# EAGLE design TRHPSVG_Controls (EAGLE 9.6.0)
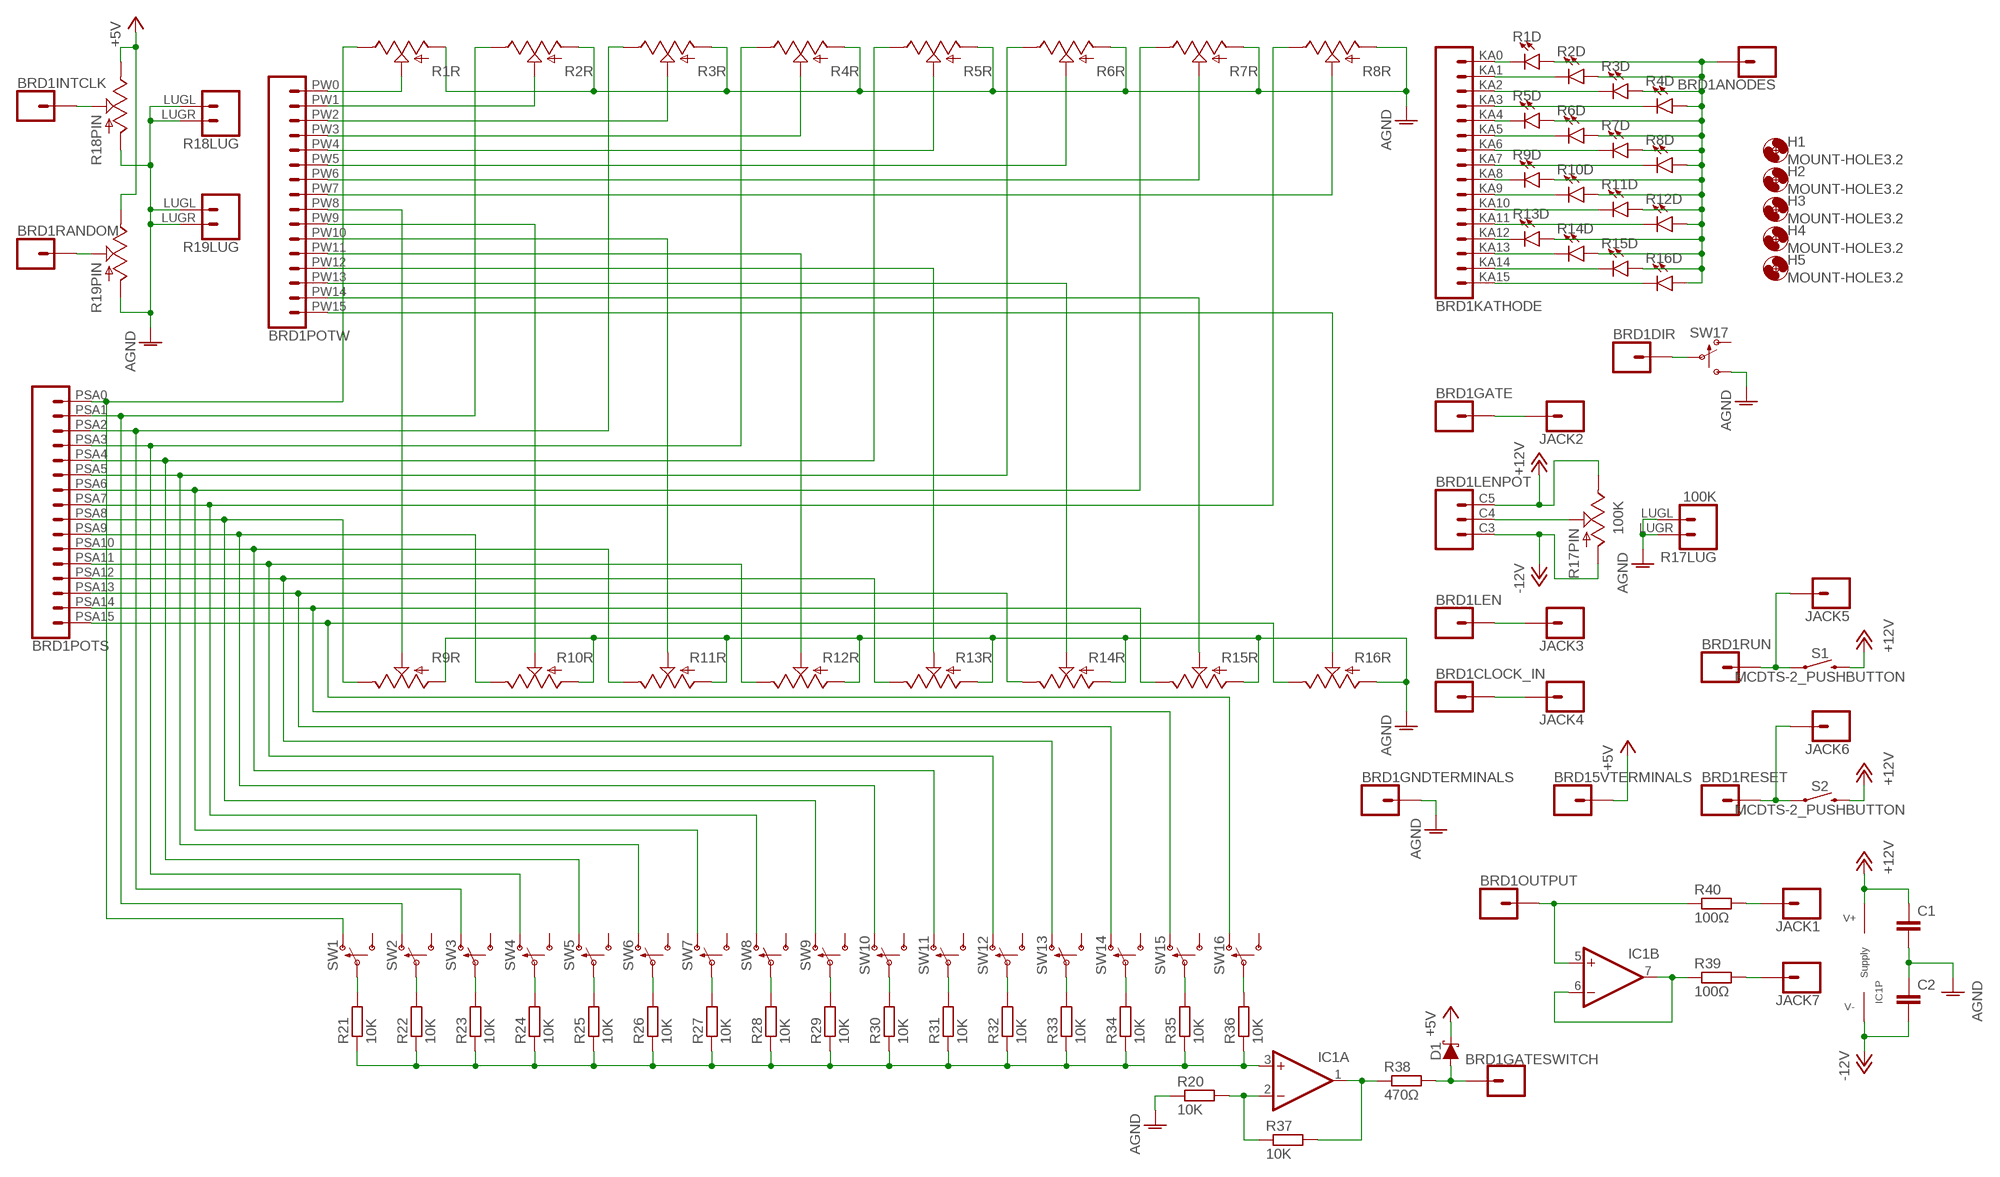
[diagram p0: schematic, sheet 1]

## Parts
BRD1  TRHPSVG_LINK  [TRHPSVG]
C1  C-EU050-025X075  [C050-025X075]
C2  C-EU050-025X075  [C050-025X075]
D1  SCHOTTKY_DO35  [DO35-7]
H1  MOUNT-HOLE3.2  [3,2]
H2  MOUNT-HOLE3.2  [3,2]
H3  MOUNT-HOLE3.2  [3,2]
H4  MOUNT-HOLE3.2  [3,2]
H5  MOUNT-HOLE3.2  [3,2]
IC1  TL0X2DIL  [DIL08]
JACK1  1XWIREPAD  [1X01]
JACK2  1XWIREPAD  [1X01]
JACK3  1XWIREPAD  [1X01]
JACK4  1XWIREPAD  [1X01]
JACK5  1XWIREPAD  [1X01]
JACK6  1XWIREPAD  [1X01]
JACK7  1XWIREPAD  [1X01]
R1  PTL30_SLIDER  [LEDSLIDER45MM]
R2  PTL30_SLIDER  [LEDSLIDER45MM]
R3  PTL30_SLIDER  [LEDSLIDER45MM]
R4  PTL30_SLIDER  [LEDSLIDER45MM]
R5  PTL30_SLIDER  [LEDSLIDER45MM]
R6  PTL30_SLIDER  [LEDSLIDER45MM]
R7  PTL30_SLIDER  [LEDSLIDER45MM]
R8  PTL30_SLIDER  [LEDSLIDER45MM]
R9  PTL30_SLIDER  [LEDSLIDER45MM]
R10  PTL30_SLIDER  [LEDSLIDER45MM]
R11  PTL30_SLIDER  [LEDSLIDER45MM]
R12  PTL30_SLIDER  [LEDSLIDER45MM]
R13  PTL30_SLIDER  [LEDSLIDER45MM]
R14  PTL30_SLIDER  [LEDSLIDER45MM]
R15  PTL30_SLIDER  [LEDSLIDER45MM]
R16  PTL30_SLIDER  [LEDSLIDER45MM]
R17  100K  POTENTIOMETER  [ALPHA_RV09_9MMPOT]
R18  POTENTIOMETER  [ALPHA_RV09_9MMPOT]
R19  POTENTIOMETER  [ALPHA_RV09_9MMPOT]
R20  10K  R-EU_0207/10  [0207/10]
R21  10K  R-EU_0207/10  [0207/10]
R22  10K  R-EU_0207/10  [0207/10]
R23  10K  R-EU_0207/10  [0207/10]
R24  10K  R-EU_0207/10  [0207/10]
R25  10K  R-EU_0207/10  [0207/10]
R26  10K  R-EU_0207/10  [0207/10]
R27  10K  R-EU_0207/10  [0207/10]
R28  10K  R-EU_0207/10  [0207/10]
R29  10K  R-EU_0207/10  [0207/10]
R30  10K  R-EU_0207/10  [0207/10]
R31  10K  R-EU_0207/10  [0207/10]
R32  10K  R-EU_0207/10  [0207/10]
R33  10K  R-EU_0207/10  [0207/10]
R34  10K  R-EU_0207/10  [0207/10]
R35  10K  R-EU_0207/10  [0207/10]
R36  10K  R-EU_0207/10  [0207/10]
R37  10K  R-EU_0207/10  [0207/10]
R38  470Ω  R-EU_0207/10  [0207/10]
R39  100Ω  R-EU_0207/10  [0207/10]
R40  100Ω  R-EU_0207/10  [0207/10]
S1  MCDTS-2_PUSHBUTTON  [MCDTS-2_PUSHBUTTON]
S2  MCDTS-2_PUSHBUTTON  [MCDTS-2_PUSHBUTTON]
SW1  SPDT_SWITCHDW1  [MICRODPDT-DW1]
SW2  SPDT_SWITCHDW1  [MICRODPDT-DW1]
SW3  SPDT_SWITCHDW1  [MICRODPDT-DW1]
SW4  SPDT_SWITCHDW1  [MICRODPDT-DW1]
SW5  SPDT_SWITCHDW1  [MICRODPDT-DW1]
SW6  SPDT_SWITCHDW1  [MICRODPDT-DW1]
SW7  SPDT_SWITCHDW1  [MICRODPDT-DW1]
SW8  SPDT_SWITCHDW1  [MICRODPDT-DW1]
SW9  SPDT_SWITCHDW1  [MICRODPDT-DW1]
SW10  SPDT_SWITCHDW1  [MICRODPDT-DW1]
SW11  SPDT_SWITCHDW1  [MICRODPDT-DW1]
SW12  SPDT_SWITCHDW1  [MICRODPDT-DW1]
SW13  SPDT_SWITCHDW1  [MICRODPDT-DW1]
SW14  SPDT_SWITCHDW1  [MICRODPDT-DW1]
SW15  SPDT_SWITCHDW1  [MICRODPDT-DW1]
SW16  SPDT_SWITCHDW1  [MICRODPDT-DW1]
SW17  SPDT_SWITCHDW1  [MICRODPDT-DW1]

## Nets
+5V: BRD1.C13 BRD1.C14 BRD1.C15 D1.C R18.C3(PIN:B) R19.C3(PIN:B)
+12V: BRD1.C5 C1.1 IC1.8(P:V+) R17.C3(PIN:B) S1.P$3 S1.P$4 S2.P$3 S2.P$4
-12V: BRD1.C3 C2.2 IC1.4(P:V-) R17.C1(PIN:A)
AGND: BRD1.C16 BRD1.C17 BRD1.C18 BRD1.GNDTA0 BRD1.GNDTA1 BRD1.GNDTA2 BRD1.GNDTA3 BRD1.GNDTA4 BRD1.GNDTA5 BRD1.GNDTA6 BRD1.GNDTA7 BRD1.GNDTA8 BRD1.GNDTA9 BRD1.GNDTA10 BRD1.GNDTA11 BRD1.GNDTA12 BRD1.GNDTA13 BRD1.GNDTA14 BRD1.GNDTA15 C1.2 C2.1 R1.S1(R:A) R2.S1(R:A) R3.S1(R:A) R4.S1(R:A) R5.S1(R:A) R6.S1(R:A) R7.S1(R:A) R8.S1(R:A) R9.S1(R:A) R10.S1(R:A) R11.S1(R:A) R12.S1(R:A) R13.S1(R:A) R14.S1(R:A) R15.S1(R:A) R16.S1(R:A) R17.LUGL R17.LUGR R18.C1(PIN:A) R18.LUGL R18.LUGR R19.C1(PIN:A) R19.LUGL R19.LUGR R20.1 SW17.C3(S)
N$1: BRD1.PW0 R1.S2(R:W)
N$2: BRD1.PW3 R4.S2(R:W)
N$3: BRD1.PW1 R2.S2(R:W)
N$4: BRD1.PSA0 R1.S3(R:B) SW1.C1(O)
N$5: BRD1.PSA1 R2.S3(R:B) SW2.C1(O)
N$6: BRD1.PW2 R3.S2(R:W)
N$7: BRD1.PW4 R5.S2(R:W)
N$8: BRD1.PW5 R6.S2(R:W)
N$9: BRD1.PW6 R7.S2(R:W)
N$10: BRD1.PW7 R8.S2(R:W)
N$11: BRD1.PSA2 R3.S3(R:B) SW3.C1(O)
N$12: BRD1.PSA3 R4.S3(R:B) SW4.C1(O)
N$13: BRD1.PSA4 R5.S3(R:B) SW5.C1(O)
N$14: R36.2 SW16.C2(P)
N$15: BRD1.PSA6 R7.S3(R:B) SW7.C1(O)
N$16: BRD1.PSA7 R8.S3(R:B) SW8.C1(O)
N$17: BRD1.PW8 R9.S2(R:W)
N$18: R21.2 SW1.C2(P)
N$19: R22.2 SW2.C2(P)
N$20: BRD1.PW9 R10.S2(R:W)
N$21: R23.2 SW3.C2(P)
N$22: BRD1.PW10 R11.S2(R:W)
N$23: BRD1.PW11 R12.S2(R:W)
N$24: R24.2 SW4.C2(P)
N$25: R25.2 SW5.C2(P)
N$26: BRD1.PW12 R13.S2(R:W)
N$27: BRD1.PW13 R14.S2(R:W)
N$28: BRD1.PSA13 R14.S3(R:B) SW14.C1(O)
N$29: BRD1.PSA14 R15.S3(R:B) SW15.C1(O)
N$30: BRD1.PSA15 R16.S3(R:B) SW16.C1(O)
N$31: BRD1.PW14 R15.S2(R:W)
N$32: BRD1.PW15 R16.S2(R:W)
N$33: BRD1.KA0 R1.SE(D:C)
N$34: BRD1.AN0 BRD1.AN1 BRD1.AN2 BRD1.AN3 R1.SB(D:A) R2.SB(D:A) R3.SB(D:A) R4.SB(D:A) R5.SB(D:A) R6.SB(D:A) R7.SB(D:A) R8.SB(D:A) R9.SB(D:A) R10.SB(D:A) R11.SB(D:A) R12.SB(D:A) R13.SB(D:A) R14.SB(D:A) R15.SB(D:A) R16.SB(D:A)
N$35: BRD1.KA1 R2.SE(D:C)
N$36: BRD1.KA2 R3.SE(D:C)
N$37: BRD1.KA3 R4.SE(D:C)
N$38: BRD1.KA4 R5.SE(D:C)
N$39: BRD1.KA5 R6.SE(D:C)
N$40: BRD1.KA6 R7.SE(D:C)
N$41: BRD1.KA7 R8.SE(D:C)
N$42: BRD1.KA8 R9.SE(D:C)
N$43: BRD1.KA9 R10.SE(D:C)
N$44: BRD1.KA10 R11.SE(D:C)
N$45: BRD1.KA11 R12.SE(D:C)
N$46: BRD1.KA12 R13.SE(D:C)
N$47: BRD1.KA13 R14.SE(D:C)
N$48: BRD1.KA14 R15.SE(D:C)
N$49: BRD1.KA15 R16.SE(D:C)
N$50: BRD1.C2 JACK3.1
N$51: BRD1.C6 JACK4.1
N$52: BRD1.C0 IC1.5(B:+IN) R40.1
N$53: BRD1.C1 JACK2.1
N$54: BRD1.C11 SW17.C2(P)
N$55: BRD1.C4 R17.C2(PIN:W)
N$56: BRD1.PSA5 R6.S3(R:B) SW6.C1(O)
N$57: BRD1.C9 R18.C2(PIN:W)
N$58: BRD1.C10 R19.C2(PIN:W)
N$59: BRD1.C7 JACK5.1 S1.P$1 S1.P$2
N$60: BRD1.C8 JACK6.1 S2.P$1 S2.P$2
N$61: R26.2 SW6.C2(P)
N$62: R27.2 SW7.C2(P)
N$63: R28.2 SW8.C2(P)
N$64: R29.2 SW9.C2(P)
N$65: R30.2 SW10.C2(P)
N$66: R31.2 SW11.C2(P)
N$67: R32.2 SW12.C2(P)
N$68: R33.2 SW13.C2(P)
N$69: BRD1.PSA8 R9.S3(R:B) SW9.C1(O)
N$70: BRD1.PSA10 R11.S3(R:B) SW11.C1(O)
N$71: BRD1.PSA9 R10.S3(R:B) SW10.C1(O)
N$72: BRD1.PSA12 R13.S3(R:B) SW13.C1(O)
N$73: BRD1.PSA11 R12.S3(R:B) SW12.C1(O)
N$74: R34.2 SW14.C2(P)
N$75: R35.2 SW15.C2(P)
N$76: IC1.3(A:+IN) R21.1 R22.1 R23.1 R24.1 R25.1 R26.1 R27.1 R28.1 R29.1 R30.1 R31.1 R32.1 R33.1 R34.1 R35.1 R36.1
N$77: IC1.2(A:-IN) R20.2 R37.1
N$78: IC1.1(A:OUT) R37.2 R38.1
N$79: BRD1.C12 D1.A R38.2
N$80: IC1.6(B:-IN) IC1.7(B:OUT) R39.1
N$81: JACK7.1 R39.2
N$82: JACK1.1 R40.2
Unconnected: SW1.C3(S) SW2.C3(S) SW3.C3(S) SW4.C3(S) SW5.C3(S) SW6.C3(S) SW7.C3(S) SW8.C3(S) SW9.C3(S) SW10.C3(S) SW11.C3(S) SW12.C3(S) SW13.C3(S) SW14.C3(S) SW15.C3(S) SW16.C3(S) SW17.C1(O)

## Library data of the parts
BRD1 = ElectricNoodleBox:TRHPSVG_LINK
C1 C2 = rcl:C-EU: CAPACITOR, European symbol; SPICEPREFIX: C
D1 = ElectricNoodleBox:SCHOTTKY_DO35
H1-H5 = holes:MOUNT-HOLE: MOUNTING HOLE with drill center marker
IC1 = ElectricNoodleBox:TL0X2
JACK1-JACK7 = ElectricNoodleBox:1XWIREPAD
R1-R16 = ElectricNoodleBox:PTL30_SLIDER
R17-R19 = ElectricNoodleBox:POTENTIOMETER
R20-R40 = rcl:R-EU_: RESISTOR, European symbol; SPICEPREFIX: R
S1 S2 = ElectricNoodleBox:MCDTS-2_PUSHBUTTON
SW1-SW17 = ElectricNoodleBox:SPDT_SWITCH

## Board
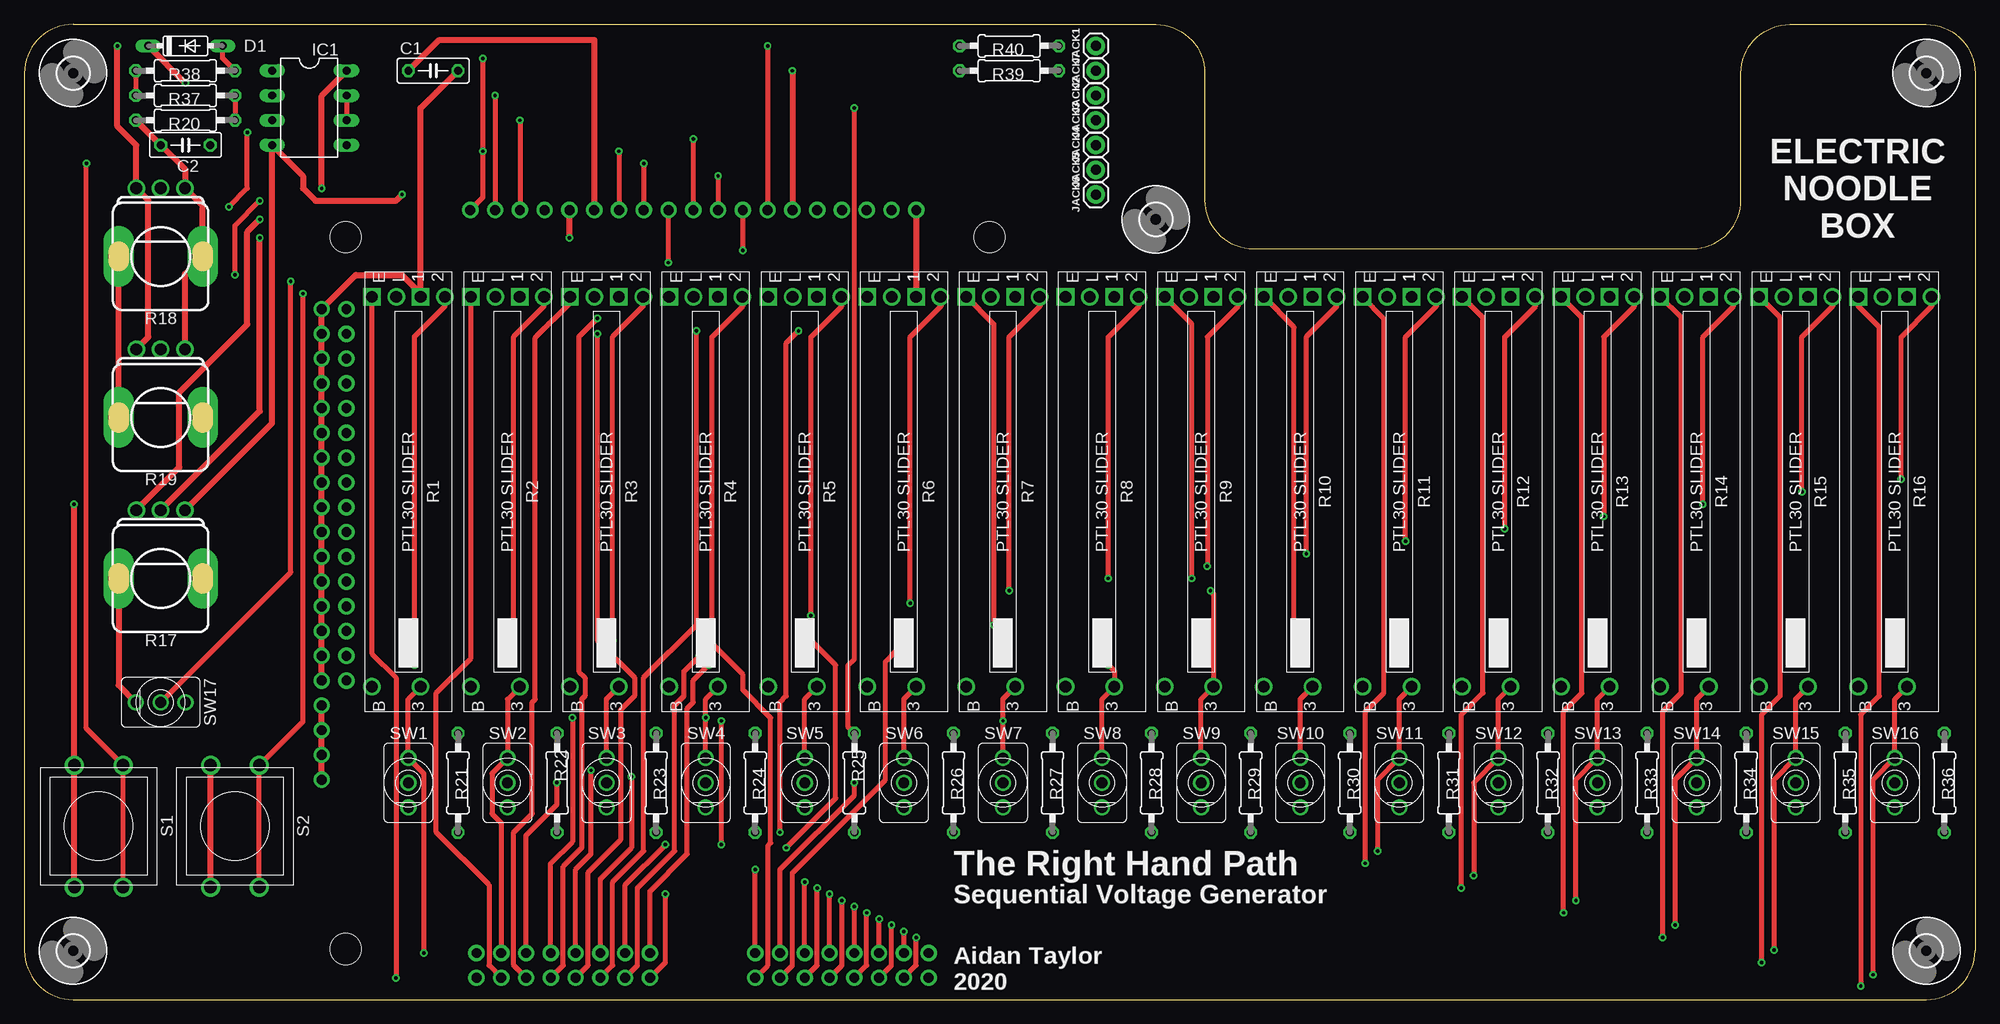
[diagram p1: board, top side]
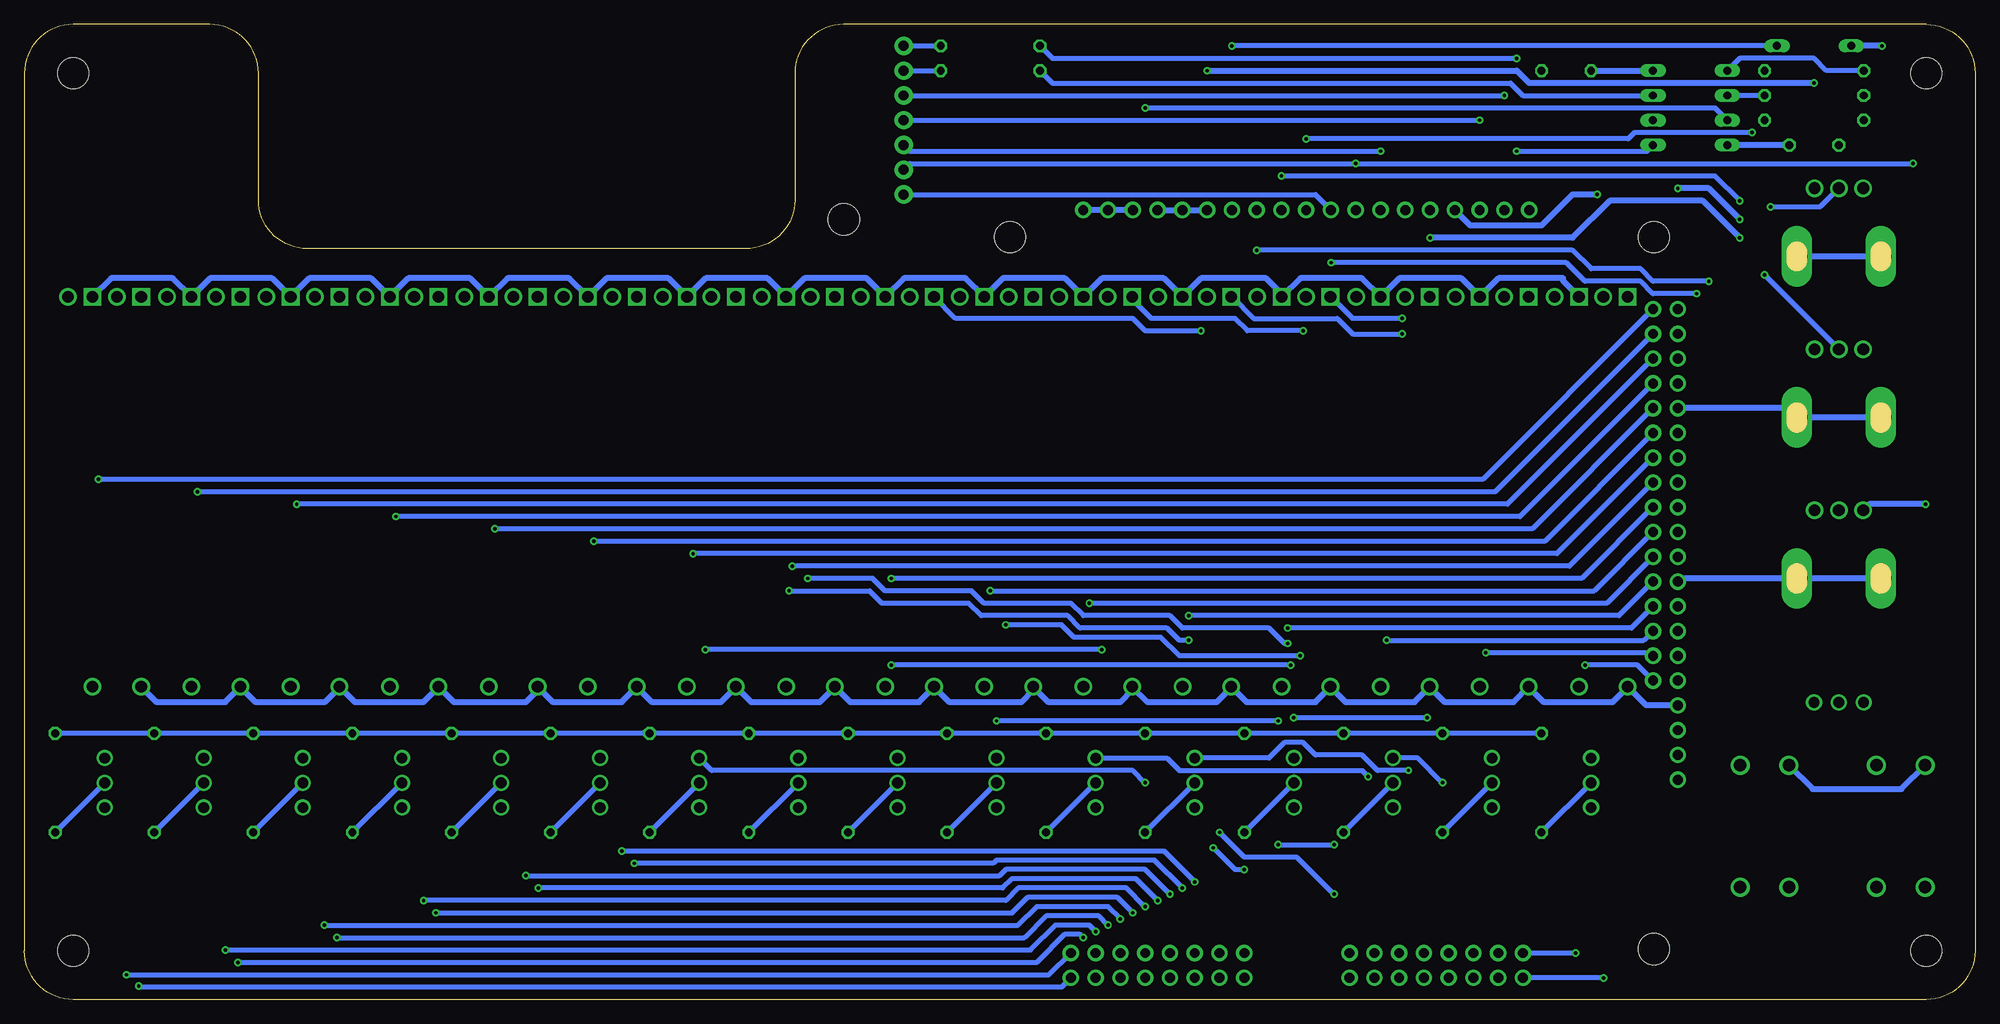
[diagram p2: board, bottom side, seen from below]

Size 200 x 100 mm. Coordinates in mm from the lower left corner, seen from the top.
Outline: 0,95 0,5 arc90 5,0 195,0 arc90 200,5 200,95 arc90 195,100 181,100 arc90 176,95 176,82 arc-90 171,77 126,77 arc-90 121,82 121,95 arc90 116,100 5,100 arc90 0,95
Copper layers (1*16): Top 0.035mm / dielectric 1.5mm / Bottom 0.035mm
Design rules "default": minimum track width 6mil, minimum drill 0.35mm, track to track 6mil, track to pad 6mil, pad to pad 6mil, via to via 6mil, smd to smd 6mil, copper to edge 40mil, drill to drill 6mil, minimum pad ring 10mil, minimum via ring 8mil, stop-mask expansion 4mil, vias tented up to drill 0mil, thermal gap 10mil

### Footprints (pad centres in the part's own frame; a part is rotated, then mirrored left to right if it is on the bottom)
TRHPSVG = drill 1.016 pad 1.676: AN0 2.54,53.023; AN1 2.54,55.562; AN2 2.54,58.102; AN3 2.54,60.642; C0 17.78,2.223; C1 20.32,2.223; C2 22.86,2.223; C3 25.4,2.223; C4 27.94,2.223; C5 30.48,2.223; C6 33.02,2.223; C7 35.56,2.223; C8 38.1,2.223; C9 40.64,2.223; C10 43.18,2.223; C11 45.72,2.223; C12 48.26,2.223; C13 50.8,2.223; C14 53.34,2.223; C15 55.88,2.223; C16 58.42,2.223; C17 60.96,2.223; C18 63.5,2.223; GNDTA0 2.54,50.483; GNDTA1 2.54,47.943; GNDTA2 2.54,45.403; GNDTA3 2.54,42.862; GNDTA4 2.54,40.322; GNDTA5 2.54,37.782; GNDTA6 2.54,35.242; GNDTA7 2.54,32.703; GNDTA8 2.54,30.163; GNDTA9 2.54,27.622; GNDTA10 2.54,25.082; GNDTA11 2.54,22.543; GNDTA12 2.54,20.003; GNDTA13 2.54,17.462; GNDTA14 2.54,14.922; GNDTA15 2.54,12.383; KA0 18.415,80.963; KA1 20.955,80.963; KA2 23.495,80.963; KA3 26.035,80.963; KA4 28.575,80.963; KA5 31.115,80.963; KA6 33.655,80.963; KA7 36.195,80.963; KA8 46.99,80.963; KA9 49.53,80.963; KA10 52.07,80.963; KA11 54.61,80.963; KA12 57.15,80.963; KA13 59.69,80.963; KA14 62.23,80.963; KA15 64.77,80.963; PSA0 18.415,78.422; PSA1 20.955,78.422; PSA2 23.495,78.422; PSA3 26.035,78.422; PSA4 28.575,78.422; PSA5 31.115,78.422; PSA6 33.655,78.422; PSA7 36.195,78.422; PSA8 46.99,78.422; PSA9 49.53,78.422; PSA10 52.07,78.422; PSA11 54.61,78.422; PSA12 57.15,78.422; PSA13 59.69,78.422; PSA14 62.23,78.422; PSA15 64.77,78.422; PW0 5.08,50.483; PW1 5.08,47.943; PW2 5.08,45.403; PW3 5.08,42.862; PW4 5.08,40.322; PW5 5.08,37.782; PW6 5.08,35.242; PW7 5.08,32.703; PW8 5.08,30.163; PW9 5.08,27.622; PW10 5.08,25.082; PW11 5.08,22.543; PW12 5.08,20.003; PW13 5.08,17.462; PW14 5.08,14.922; PW15 5.08,12.383 | hole 3.2: 5,5; 71,5; 5,78
C050-025X075 = drill 0.813 octagon: 1 -2.54,0; 2 2.54,0
DO35-7 = drill 0.813 long: A 3.81,0; C -3.81,0
3,2 = hole 3.2: 0,0
DIL08 = drill 0.813 long: 1 -3.81,-3.81; 2 -1.27,-3.81; 3 1.27,-3.81; 4 3.81,-3.81; 5 3.81,3.81; 6 1.27,3.81; 7 -1.27,3.81; 8 -3.81,3.81
1X01 = drill 1.016 pad 1.88: 1 0,0
LEDSLIDER45MM = drill 1.2 square: S1 -20,1.25; SE -20,-3.75 | drill 1.2: S2 -20,3.75; S3 20,1.25; SB 20,-3.75; SL -20,-1.25
ALPHA_RV09_9MMPOT = drill 1.2 pad 1.778: C1 -2.5,-7; C2 0,-7; C3 2.5,-7 | drill 2.1 pad 2.8 long: LUGL -4.3,0; LUGR 4.3,0
0207/10 = drill 0.813 octagon: 1 -5.08,0; 2 5.08,0
MCDTS-2_PUSHBUTTON = drill 1.3: P$1 -6.25,-2.5; P$2 6.25,-2.5; P$3 -6.25,2.5; P$4 6.25,2.5
MICRODPDT-DW1 = drill 1.1: C1 0,-2.54; C2 0,0; C3 0,2.54

### Placement (x,y rotation side)
BRD1  27.94,83.19 180 bottom
C1  41.91,95.25 0 top
C2  16.51,87.63 0 top
D1  16.51,97.79 0 top
H1  5,5 0 top
H2  195,5 0 top
H3  5,95 0 top
H4  195,95 0 top
H5  116,80 0 top
IC1  29.21,91.44 270 top
JACK1  109.86,97.79 0 top
JACK2  109.86,92.71 0 top
JACK3  109.86,90.17 0 top
JACK4  109.86,87.63 0 top
JACK5  109.86,85.09 0 top
JACK6  109.86,82.55 0 top
JACK7  109.86,95.25 0 top
R1  39.37,52.07 270 top
R2  49.53,52.07 270 top
R3  59.69,52.07 270 top
R4  69.85,52.07 270 top
R5  80.01,52.07 270 top
R6  90.17,52.07 270 top
R7  100.33,52.07 270 top
R8  110.49,52.07 270 top
R9  120.65,52.07 270 top
R10  130.81,52.07 270 top
R11  140.97,52.07 270 top
R12  151.13,52.07 270 top
R13  161.29,52.07 270 top
R14  171.45,52.07 270 top
R15  181.61,52.07 270 top
R16  191.77,52.07 270 top
R17  13.97,43.18 180 top
R18  13.97,76.2 180 top
R19  13.97,59.69 180 top
R20  16.51,90.17 0 top
R21  44.45,22.23 270 top
R22  54.61,22.23 270 top
R23  64.77,22.23 270 top
R24  74.93,22.23 270 top
R25  85.09,22.23 270 top
R26  95.25,22.23 270 top
R27  105.41,22.23 270 top
R28  115.57,22.23 270 top
R29  125.73,22.23 270 top
R30  135.89,22.23 270 top
R31  146.05,22.23 270 top
R32  156.21,22.23 270 top
R33  166.37,22.23 270 top
R34  176.53,22.23 270 top
R35  186.69,22.23 270 top
R36  196.85,22.23 270 top
R37  16.51,92.71 180 top
R38  16.51,95.25 0 top
R39  100.97,95.25 0 top
R40  100.97,97.79 0 top
S1  7.62,17.78 90 top
S2  21.59,17.78 90 top
SW1  39.37,22.23 180 top
SW2  49.53,22.23 180 top
SW3  59.69,22.23 180 top
SW4  69.85,22.23 180 top
SW5  80.01,22.23 180 top
SW6  90.17,22.23 180 top
SW7  100.33,22.23 180 top
SW8  110.49,22.23 180 top
SW9  120.65,22.23 180 top
SW10  130.81,22.23 180 top
SW11  140.97,22.23 180 top
SW12  151.13,22.23 180 top
SW13  161.29,22.23 180 top
SW14  171.45,22.23 180 top
SW15  181.61,22.23 180 top
SW16  191.77,22.23 180 top
SW17  13.97,30.48 90 top

### Tracks (layer width: path | path; a pad name or v marks a point on that pad's centre or on a via)
+5V  (via drill 0.35)
  Top 0.61: R19.C3 11.47,66.72 12.7,67.94 12.7,81.97 R18.C3 11.47,87.59 9.53,89.53 v9.53,97.79 | D1.C v16.51,93.98 | v78.74,95.25 BRD1.C13
  Bottom 0.61: BRD1.C15 BRD1.C14 BRD1.C13 | v9.53,97.79 D1.C | v16.51,93.98 45.72,93.98 46.99,95.25 v78.74,95.25
+12V  (via drill 0.35)
  Top 0.61: S2.P$3 S2.P$4 | S1.P$3 S1.P$4 5.12,50.76 v5.08,50.8 | R17.C3 15.88,54.59 15.88,62.23 22.86,69.22 22.86,78.74 v24.13,80.01 | v30.48,83.19 30.48,92.71 IC1.8 | C1.1 42.55,98.42 58.42,98.42 BRD1.C5
  Bottom 0.61: S2.P$4 16.65,21.59 7.56,21.59 S1.P$4 | v5.08,50.8 10.85,50.8 R17.C3 | v24.13,80.01 27.3,83.19 v30.48,83.19 | C1.1 IC1.8
-12V  (via drill 0.35)
  Top 0.61: R17.C1 25.4,59.11 IC1.4 28.57,84.45 28.57,83.19 29.84,81.92 38.1,81.92 v38.73,82.55
  Bottom 0.61: C2.2 IC1.4 | v38.73,82.55 41.27,82.55 44.45,79.38 51.75,79.38 BRD1.C3
AGND
  Top 0.61: BRD1.GNDTA0 BRD1.GNDTA1 BRD1.GNDTA2 BRD1.GNDTA3 BRD1.GNDTA4 BRD1.GNDTA5 BRD1.GNDTA6 BRD1.GNDTA7 BRD1.GNDTA8 BRD1.GNDTA9 BRD1.GNDTA10 BRD1.GNDTA11 BRD1.GNDTA12 BRD1.GNDTA13 BRD1.GNDTA14 BRD1.GNDTA15 33.97,74.3 38.72,74.3 40.62,72.39 | R17.LUGR 9.67,32.24 SW17.C3 | R1.S1 40.62,72.39 | 40.62,72.39 40.62,91.42 C1.2 | R19.LUGR R18.LUGR | R19.C1 16.47,74.4 R18.LUGL 18.27,81.4 R18.C1 16.47,85.13 C2.1 R20.1 | BRD1.C18 91.44,72.09 R6.S1
  Bottom 0.61: R1.S1 42.23,73.68 42.23,73.98 48.87,73.98 R2.S1 52.69,73.98 59.03,73.98 R3.S1 62.85,73.98 69.19,73.98 R4.S1 71.1,72.37 72.71,73.98 79.35,73.98 R5.S1 83.17,73.98 89.51,73.98 R6.S1 93.33,73.98 99.67,73.98 R7.S1 103.49,73.98 109.83,73.98 R8.S1 113.65,73.98 119.99,73.98 R9.S1 123.81,73.98 130.15,73.98 R10.S1 133.97,73.98 140.31,73.98 R11.S1 144.13,73.98 150.47,73.98 R12.S1 154.29,73.98 160.63,73.98 R13.S1 164.45,73.98 170.79,73.98 R14.S1 174.61,73.98 180.95,73.98 R15.S1 184.77,73.98 191.11,73.98 R16.S1 | BRD1.GNDTA4 30.16,43.18 R17.LUGL R17.LUGR | R19.LUGR R19.LUGL 19.22,60.64 BRD1.GNDTA11 | R18.LUGR R18.LUGL | BRD1.C16 BRD1.C17 BRD1.C18
N$1  (via drill 0.35)
  Top 0.508: v40.01,34.29 40.01,68 43.12,71.12 R1.S2
  Bottom 0.508: BRD1.PW0 34.61,34.29 v40.01,34.29
N$2  (via drill 0.35)
  Top 0.508: v70.48,38.1 70.48,67.94 73.66,71.12 73.66,72.01 R4.S2
  Bottom 0.508: BRD1.PW3 35.24,38.1 v70.48,38.1
N$3  (via drill 0.35)
  Top 0.508: v50.16,35.56 50.16,68 53.28,71.12 R2.S2
  Bottom 0.508: BRD1.PW1 33.34,35.56 v50.16,35.56
N$4  (via drill 0.35)
  Top 0.508: v40.96,4.76 40.96,23.18 SW1.C1 39.37,30.82 R1.S3
  Bottom 0.508: v40.96,4.76 BRD1.PSA0
N$5
  Top 0.508: BRD1.PSA1 48.9,18.1 47.94,19.05 47.94,23.18 SW2.C1 49.53,30.8 50.78,32.05 R2.S3
N$6  (via drill 0.35)
  Top 0.508: v60.33,36.83 60.33,68 63.44,71.12 R3.S2
  Bottom 0.508: v60.33,36.83 33.97,36.83 BRD1.PW2
N$7  (via drill 0.35)
  Top 0.508: v80.64,39.37 80.64,67.94 83.82,71.12 83.82,72.01 R5.S2
  Bottom 0.508: BRD1.PW4 36.51,39.37 v80.64,39.37
N$8  (via drill 0.35)
  Top 0.508: v90.81,40.64 90.81,67.94 93.98,71.12 93.98,72.01 R6.S2
  Bottom 0.508: v90.81,40.64 37.78,40.64 BRD1.PW5
N$9  (via drill 0.35)
  Top 0.508: v100.97,41.91 100.97,67.94 104.14,71.12 104.14,72.01 R7.S2
  Bottom 0.508: v100.97,41.91 39.05,41.91 BRD1.PW6
N$10  (via drill 0.35)
  Top 0.508: v111.12,43.18 111.12,67.94 114.3,71.12 114.3,72.01 R8.S2
  Bottom 0.508: BRD1.PW7 40.32,43.18 v111.12,43.18
N$11  (via drill 0.35)
  Top 0.508: SW3.C1 59.69,30.82 R3.S3 | BRD1.PSA2 51.44,16.83 54.61,20 v54.61,22.23
  Bottom 0.508: v54.61,22.23 57.15,24.77 SW3.C1
N$12  (via drill 0.35)
  Top 0.508: BRD1.PSA3 53.98,13.97 56.2,16.19 v56.2,28.89 | SW4.C1 v69.85,28.89 69.85,30.82 R4.S3
  Bottom 0.508: v56.2,28.89 v69.85,28.89
N$13  (via drill 0.35)
  Top 0.508: BRD1.PSA4 56.52,13.34 58.1,14.92 v58.1,23.5 | SW5.C1 80.01,30.82 R5.S3
  Bottom 0.508: SW5.C1 72.39,24.77 70.8,26.35 68.9,26.35 67.63,25.08 62.87,25.08 61.28,23.5 v58.1,23.5
N$14
  Bottom 0.508: R36.2 SW16.C2
N$15  (via drill 0.35)
  Top 0.508: SW7.C1 v100.33,28.57 100.33,30.82 R7.S3 | BRD1.PSA6 61.59,11.75 v65.72,15.88 | v71.44,28.57 v71.44,15.88
  Bottom 0.508: v71.44,28.57 v100.33,28.57 | v71.44,15.88 v65.72,15.88
N$16  (via drill 0.35)
  Top 0.508: SW8.C1 110.49,30.82 R8.S3 111.74,33.67 v111.12,34.29 | BRD1.PSA7 64.14,11.11 67.94,14.92 67.94,29.84 68.58,30.48 68.58,32.7 v70.17,34.29
  Bottom 0.508: v70.17,34.29 v111.12,34.29
N$17  (via drill 0.35)
  Top 0.508: v121.28,44.45 121.28,67.94 124.46,71.12 124.46,72.01 R9.S2
  Bottom 0.508: BRD1.PW8 41.59,44.45 v121.28,44.45
N$18
  Bottom 0.508: SW1.C2 R21.2
N$19
  Bottom 0.508: SW2.C2 R22.2
N$20  (via drill 0.35)
  Top 0.508: v131.44,45.72 131.44,68 134.56,71.12 R10.S2
  Bottom 0.508: BRD1.PW9 42.86,45.72 v131.44,45.72
N$21
  Bottom 0.508: R23.2 SW3.C2
N$22  (via drill 0.35)
  Top 0.508: v141.6,46.99 141.6,67.94 144.78,71.12 144.78,72.01 R11.S2
  Bottom 0.508: BRD1.PW10 44.13,46.99 v141.6,46.99
N$23  (via drill 0.35)
  Top 0.508: v151.76,48.26 151.76,67.94 154.94,71.12 154.94,72.01 R12.S2
  Bottom 0.508: BRD1.PW11 45.4,48.26 v151.76,48.26
N$24
  Bottom 0.508: R24.2 SW4.C2
N$25
  Bottom 0.508: R25.2 SW5.C2
N$26  (via drill 0.35)
  Top 0.508: v161.93,49.53 161.93,67.94 165.1,71.12 165.1,72.01 R13.S2
  Bottom 0.508: BRD1.PW12 46.67,49.53 v161.93,49.53
N$27  (via drill 0.35)
  Top 0.508: v172.09,50.8 172.09,67.94 175.26,71.12 175.26,72.01 R14.S2
  Bottom 0.508: BRD1.PW13 47.94,50.8 v172.09,50.8
N$28  (via drill 0.35)
  Top 0.508: R14.S3 171.45,30.82 SW14.C1 169.23,22.54 v169.23,7.62 | BRD1.PSA13 v87.63,8.26
  Bottom 0.508: v87.63,8.26 88.9,9.53 96.2,9.53 98.11,7.62 v169.23,7.62
N$29  (via drill 0.35)
  Top 0.508: R15.S3 181.61,30.82 SW15.C1 179.39,22.54 v179.39,5.08 | BRD1.PSA14 v90.17,6.99
  Bottom 0.508: v179.39,5.08 96.84,5.08 94.3,7.62 90.81,7.62 v90.17,6.99
N$30  (via drill 0.35)
  Top 0.508: R16.S3 191.77,30.82 SW16.C1 189.55,22.54 v189.55,2.54
  Bottom 0.508: v189.55,2.54 94.93,2.54 BRD1.PSA15
N$31  (via drill 0.35)
  Top 0.508: v182.25,52.07 182.25,67.94 185.42,71.12 185.42,72.01 R15.S2
  Bottom 0.508: BRD1.PW14 49.21,52.07 v182.25,52.07
N$32  (via drill 0.35)
  Top 0.508: v192.41,53.34 192.41,67.94 195.58,71.12 195.58,72.01 R16.S2
  Bottom 0.508: BRD1.PW15 50.48,53.34 v192.41,53.34
N$33  (via drill 0.35)
  Top 0.508: R1.SE 35.62,35.5 38.1,33.02 v38.1,2.22
  Bottom 0.508: v38.1,2.22 BRD1.KA0
N$34
  Top 0.61: BRD1.AN3 BRD1.AN2 BRD1.AN1 BRD1.AN0
  Bottom 0.61: BRD1.AN0 33.71,30.16 R1.SB 37.15,30.54 37.15,30.48 44.19,30.48 R2.SB 47.31,30.54 47.31,30.48 54.35,30.48 R3.SB 57.47,30.54 57.47,30.48 64.51,30.48 R4.SB 67.63,30.54 67.63,30.48 74.67,30.48 R5.SB 76.26,32.01 77.79,30.48 84.83,30.48 R6.SB 86.42,31.69 87.63,30.48 94.99,30.48 R7.SB 96.58,31.69 97.79,30.48 105.15,30.48 R8.SB 108.27,30.54 108.27,30.48 115.31,30.48 R9.SB 118.43,30.54 118.43,30.48 125.47,30.48 R10.SB 128.59,30.54 128.59,30.48 135.63,30.48 R11.SB 138.75,30.54 138.75,30.48 145.79,30.48 R12.SB 147.38,31.69 148.59,30.48 155.95,30.48 R13.SB 159.07,30.54 159.07,30.48 166.11,30.48 R14.SB 167.7,32.01 169.23,30.48 176.27,30.48 R15.SB 179.39,30.54 179.39,30.48 186.43,30.48 R16.SB
N$35
  Top 0.508: BRD1.KA1 47.62,3.49 47.62,11.75 42.23,17.14 42.23,31.43 45.78,34.98 R2.SE
N$36
  Top 0.508: BRD1.KA2 50.16,3.49 50.16,17.14 52.07,19.05 52.07,30.48 52.39,30.8 52.39,67.88 55.94,71.44 R3.SE
N$37  (via drill 0.35)
  Top 0.508: BRD1.KA3 55.24,3.49 55.24,13.65 57.15,15.56 57.15,30.8 57.47,31.11 57.47,33.02 56.83,33.66 56.83,67.94 v58.74,69.85
  Bottom 0.508: v58.74,69.85 63.82,69.85 66.04,72.07 R4.SE
N$38  (via drill 0.35)
  Top 0.508: BRD1.KA4 57.81,3.52 57.81,13.04 61.12,16.35 61.12,29.69 62.55,31.11 62.55,33.02 58.74,36.83 v58.74,68.26
  Bottom 0.508: R5.SE 76.2,72.07 73.98,69.85 65.41,69.85 63.82,68.26 v58.74,68.26
N$39  (via drill 0.35)
  Top 0.508: BRD1.KA5 60.33,3.49 60.33,12.06 63.5,15.24 63.5,33.02 68.9,38.42 v68.9,68.58
  Bottom 0.508: R6.SE 86.42,71.81 84.45,69.85 75.88,69.85 74.61,68.58 v68.9,68.58
N$40  (via drill 0.35)
  Top 0.508: BRD1.KA6 62.87,3.49 62.87,11.43 66.67,15.24 66.67,30.16 67.63,31.11 67.63,33.66 v69.22,35.24 | v99.38,38.42 99.38,69.27 R7.SE
  Bottom 0.508: v69.22,35.24 81.6,35.24 83.5,37.15 92.39,37.15 93.66,38.42 v99.38,38.42
N$41  (via drill 0.35)
  Top 0.508: BRD1.KA7 65.72,3.81 v65.72,10.79 | v77.47,17.14 77.47,30.48 78.11,31.11 78.11,67.31 v79.38,68.58
  Bottom 0.508: R8.SE 104.52,69.85 86.36,69.85 85.09,68.58 v79.38,68.58 | v65.72,10.79 69.53,14.61 74.93,14.61 v77.47,17.14
N$42  (via drill 0.35)
  Top 0.508: v70.48,36.51 73.66,33.34 73.66,31.75 76.52,28.89 76.52,16.05 76.22,15.76 76.22,3.52 BRD1.KA8 | v119.7,43.18 119.7,69.27 R9.SE
  Bottom 0.508: v119.7,43.18 113.03,43.18 111.76,41.91 102.87,41.91 101.6,40.64 92.71,40.64 91.44,39.37 82.55,39.37 81.28,38.1 72.39,38.1 70.8,36.51 v70.48,36.51
N$43  (via drill 0.35)
  Top 0.508: BRD1.KA9 78.74,3.49 78.74,13.02 88.27,22.54 88.27,34.61 v89.53,35.88 | v130.18,35.88 130.18,68.95 R10.SE
  Bottom 0.508: v89.53,35.88 v130.18,35.88
N$44  (via drill 0.35)
  Top 0.508: BRD1.KA10 81.28,3.49 v81.28,11.43 | R11.SE 137.22,72.01 139.38,69.85 139.38,31.43 137.48,29.53 v137.48,13.97
  Bottom 0.508: v81.28,11.43 84.14,14.29 100.33,14.29 100.65,13.97 v137.48,13.97
N$45  (via drill 0.35)
  Top 0.508: BRD1.KA11 83.82,3.49 v83.82,10.16 | v147.32,11.43 147.32,29.21 149.54,31.43 149.54,69.91 R12.SE
  Bottom 0.508: v83.82,10.16 86.04,12.38 98.74,12.38 99.69,11.43 v147.32,11.43
N$46  (via drill 0.35)
  Top 0.508: BRD1.KA12 86.36,3.49 v86.36,8.89 | v157.8,8.89 157.8,29.53 159.7,31.43 159.7,69.91 R13.SE
  Bottom 0.508: v86.36,8.89 87.95,10.48 97.16,10.48 98.74,8.89 v157.8,8.89
N$47  (via drill 0.35)
  Top 0.508: BRD1.KA13 88.9,3.49 v88.9,7.62 | v167.96,6.35 167.96,29.53 169.86,31.43 169.86,69.91 R14.SE
  Bottom 0.508: v88.9,7.62 89.85,8.57 95.25,8.57 97.47,6.35 v167.96,6.35
N$48  (via drill 0.35)
  Top 0.508: BRD1.KA14 91.44,3.49 v91.44,6.35 | v178.12,3.81 178.12,29.21 180.02,31.11 180.02,69.91 R15.SE
  Bottom 0.508: v91.44,6.35 91.76,6.67 93.34,6.67 96.2,3.81 v178.12,3.81
N$49  (via drill 0.35)
  Top 0.508: v188.28,1.39 188.28,29.21 190.18,31.11 190.18,68.95 188.02,71.12 R16.SE
  Bottom 0.508: BRD1.KA15 93.66,1.27 188.4,1.27 v188.28,1.39
N$50  (via drill 0.35)
  Top 0.508: v50.8,90.17 BRD1.C2
  Bottom 0.508: JACK3.1 v50.8,90.17
N$51  (via drill 0.35)
  Top 0.508: v60.96,87 BRD1.C6
  Bottom 0.508: JACK4.1 109.22,87 v60.96,87
N$52  (via drill 0.35)
  Top 0.508: v46.99,96.52 v46.99,87 46.99,82.23 BRD1.C0
  Bottom 0.508: R40.1 94.61,96.52 v46.99,96.52 | v46.99,87 33.66,87 IC1.5
N$53  (via drill 0.35)
  Top 0.508: v48.26,92.71 BRD1.C1
  Bottom 0.508: JACK2.1 v48.26,92.71
N$54  (via drill 0.35)
  Top 0.508: SW17.C2 27.3,43.81 v27.3,73.66 | v73.66,76.83 BRD1.C11
  Bottom 0.508: v73.66,76.83 41.27,76.83 39.37,74.93 34.29,74.93 33.02,73.66 v27.3,73.66
N$55  (via drill 0.35)
  Top 0.61: R17.C2 24.13,60.34 v24.13,78.11 | v55.88,78.11 BRD1.C4
  Bottom 0.61: v24.13,78.11 27.94,81.92 37.47,81.92 41.27,78.11 v55.88,78.11
N$56  (via drill 0.35)
  Top 0.508: SW6.C1 90.17,30.82 R6.S3 | BRD1.PSA5 59.05,12.38 62.23,15.56 v62.23,22.86
  Bottom 0.508: SW6.C1 82.87,24.77 81.6,23.5 62.87,23.5 v62.23,22.86
N$57  (via drill 0.35)
  Top 0.508: v20.95,81.28 22.86,83.19 v22.86,88.9 | v68.58,88.27 BRD1.C9
  Bottom 0.508: R18.C2 15.88,81.3 15.88,81.28 v20.95,81.28 | v22.86,88.9 34.92,88.9 35.56,88.27 v68.58,88.27
N$58  (via drill 0.35)
  Top 0.508: v21.59,74.3 21.59,79.38 v24.13,81.92 | v71.12,84.45 BRD1.C10
  Bottom 0.508: R19.C2 21.57,74.3 v21.59,74.3 | v24.13,81.92 26.67,84.45 v71.12,84.45
N$59  (via drill 0.35)
  Top 0.508: v63.5,85.72 BRD1.C7 | S1.P$1 S1.P$2 6.35,27.8 v6.35,85.72
  Bottom 0.508: JACK5.1 109.22,85.72 v63.5,85.72 v6.35,85.72
N$60  (via drill 0.35)
  Top 0.508: S2.P$1 S2.P$2 28.57,28.52 v28.57,72.39 | v66.04,75.56 BRD1.C8
  Bottom 0.508: JACK6.1 67.63,82.55 BRD1.C8 | v28.57,72.39 33.02,72.39 34.29,73.66 40.01,73.66 41.91,75.56 v66.04,75.56
N$61
  Bottom 0.508: R26.2 SW6.C2
N$62
  Bottom 0.508: R27.2 SW7.C2
N$63
  Bottom 0.508: R28.2 SW8.C2
N$64
  Bottom 0.508: R29.2 SW9.C2
N$65
  Bottom 0.508: R30.2 SW10.C2
N$66
  Bottom 0.508: R31.2 SW11.C2
N$67
  Bottom 0.508: R32.2 SW12.C2
N$68
  Bottom 0.508: R33.2 SW13.C2
N$69  (via drill 0.35)
  Top 0.508: SW9.C1 120.65,30.82 R9.S3 121.9,32.35 121.92,32.37 121.92,41.59 v121.6,41.91 | BRD1.PSA8 v74.93,13.34 | v78.11,15.56 83.19,20.64 83.19,34.29 v80.64,36.83
  Bottom 0.508: v78.11,15.56 75.88,13.34 v74.93,13.34 | v80.64,36.83 81.6,36.83 82.87,38.1 91.76,38.1 93.03,39.37 101.92,39.37 103.19,40.64 112.08,40.64 113.35,41.91 v121.6,41.91
N$70  (via drill 0.35)
  Top 0.508: R11.S3 140.97,30.82 SW11.C1 138.75,22.54 v138.75,15.24 | BRD1.PSA10 v80.01,12.06
  Bottom 0.508: v80.01,12.06 83.19,15.24 v138.75,15.24
N$71  (via drill 0.35)
  Top 0.508: SW10.C1 130.81,30.82 R10.S3 | v85.09,22.23 85.09,20.95 77.47,13.34 BRD1.PSA9
  Bottom 0.508: v85.09,22.23 86.36,23.5 129.54,23.5 SW10.C1
N$72  (via drill 0.35)
  Top 0.508: R13.S3 161.29,30.82 SW13.C1 159.07,22.54 v159.07,10.16 | BRD1.PSA12 v85.09,9.53
  Bottom 0.508: v85.09,9.53 87,11.43 98.11,11.43 99.38,10.16 v159.07,10.16
N$73  (via drill 0.35)
  Top 0.508: R12.S3 151.13,30.82 SW12.C1 148.59,22.23 v148.59,12.7 | BRD1.PSA11 v82.55,10.79
  Bottom 0.508: v82.55,10.79 85.09,13.34 99.38,13.34 100.01,12.7 v148.59,12.7
N$74
  Bottom 0.508: R34.2 SW14.C2
N$75
  Bottom 0.508: R35.2 SW15.C2
N$76  (via drill 0.35)
  Top 0.508: R25.1 84.45,27.94 84.45,34.29 85.09,34.92 v85.09,91.44
  Bottom 0.508: R21.1 R22.1 R23.1 R24.1 R25.1 R26.1 R27.1 R28.1 R29.1 R30.1 R31.1 R32.1 R33.1 R34.1 R35.1 R36.1 | v85.09,91.44 26.67,91.44 IC1.3
N$77
  Top 0.508: R37.1 R20.2
  Bottom 0.508: R37.1 IC1.2
N$78
  Top 0.508: R38.1 R37.2
  Bottom 0.508: R38.1 15.24,95.25 16.51,96.52 24.13,96.52 IC1.1
N$79  (via drill 0.35)
  Top 0.508: R38.2 20.32,96.52 D1.A | v76.2,97.79 BRD1.C12
  Bottom 0.508: D1.A v76.2,97.79
N$80
  Top 0.508: IC1.7 IC1.6
  Bottom 0.508: IC1.7 46.35,92.71 47.62,93.98 94.61,93.98 R39.1
N$81
  Bottom 0.508: JACK7.1 R39.2
N$82
  Bottom 0.508: JACK1.1 R40.2

### Text on the board
tPlace: ELECTRIC / NOODLE / BOX | The Right Hand Path | Sequential Voltage Generator | Aidan Taylor / 2020